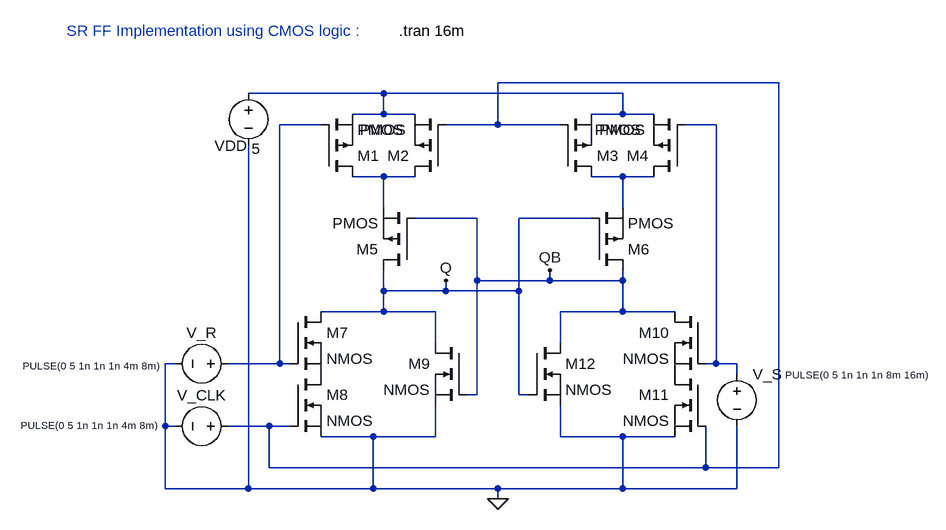
[diagram p0: schematic SR_FF_CMOS.asc]
SR_FF_CMOS.asc, the LTspice schematic file:
Version 4
SHEET 1 1336 680
WIRE 1024 -2000 592 -2000
WIRE 416 -1984 208 -1984
WIRE 784 -1984 416 -1984
WIRE 416 -1952 416 -1984
WIRE 416 -1952 368 -1952
WIRE 464 -1952 416 -1952
WIRE 784 -1952 784 -1984
WIRE 784 -1952 736 -1952
WIRE 832 -1952 784 -1952
WIRE 320 -1936 256 -1936
WIRE 592 -1936 592 -2000
WIRE 592 -1936 512 -1936
WIRE 688 -1936 592 -1936
WIRE 928 -1936 880 -1936
WIRE 416 -1856 368 -1856
WIRE 464 -1856 416 -1856
WIRE 784 -1856 736 -1856
WIRE 832 -1856 784 -1856
WIRE 416 -1808 416 -1856
WIRE 784 -1808 784 -1856
WIRE 560 -1792 464 -1792
WIRE 736 -1792 624 -1792
WIRE 560 -1696 560 -1792
WIRE 672 -1696 672 -1712
WIRE 672 -1696 560 -1696
WIRE 784 -1696 784 -1712
WIRE 784 -1696 672 -1696
WIRE 416 -1680 416 -1712
WIRE 512 -1680 512 -1696
WIRE 512 -1680 416 -1680
WIRE 624 -1680 624 -1792
WIRE 624 -1680 512 -1680
WIRE 416 -1648 416 -1680
WIRE 416 -1648 320 -1648
WIRE 496 -1648 416 -1648
WIRE 784 -1648 784 -1696
WIRE 784 -1648 688 -1648
WIRE 864 -1648 784 -1648
WIRE 496 -1600 496 -1648
WIRE 688 -1600 688 -1648
WIRE 96 -1568 80 -1568
WIRE 256 -1568 256 -1936
WIRE 256 -1568 176 -1568
WIRE 272 -1568 256 -1568
WIRE 928 -1568 928 -1936
WIRE 928 -1568 912 -1568
WIRE 960 -1568 928 -1568
WIRE 960 -1552 960 -1568
WIRE 560 -1520 560 -1696
WIRE 560 -1520 544 -1520
WIRE 624 -1520 624 -1680
WIRE 640 -1520 624 -1520
WIRE 80 -1472 80 -1568
WIRE 96 -1472 80 -1472
WIRE 240 -1472 176 -1472
WIRE 272 -1472 240 -1472
WIRE 400 -1456 320 -1456
WIRE 496 -1456 496 -1504
WIRE 496 -1456 400 -1456
WIRE 688 -1456 688 -1504
WIRE 784 -1456 688 -1456
WIRE 864 -1456 784 -1456
WIRE 240 -1408 240 -1472
WIRE 912 -1408 912 -1472
WIRE 912 -1408 240 -1408
WIRE 1024 -1408 1024 -2000
WIRE 1024 -1408 912 -1408
WIRE 80 -1376 80 -1472
WIRE 208 -1376 208 -1904
WIRE 208 -1376 80 -1376
WIRE 400 -1376 400 -1456
WIRE 400 -1376 208 -1376
WIRE 592 -1376 400 -1376
WIRE 784 -1376 784 -1456
WIRE 784 -1376 592 -1376
WIRE 960 -1376 960 -1472
WIRE 960 -1376 784 -1376
WIRE 592 -1360 592 -1376
FLAG 592 -1360 0
FLAG 672 -1712 QB
FLAG 512 -1696 Q
SYMBOL pmos 512 -1856 R180
WINDOW 3 66 72 Left 2
SYMATTR InstName M2
SYMBOL pmos 880 -1856 R180
WINDOW 3 68 72 Left 2
SYMATTR InstName M4
SYMBOL pmos 464 -1712 R180
SYMATTR InstName M5
SYMBOL pmos 736 -1712 M180
SYMATTR InstName M6
SYMBOL nmos 272 -1648 R0
SYMATTR InstName M7
SYMBOL nmos 272 -1552 R0
SYMATTR InstName M8
SYMBOL nmos 544 -1600 M0
SYMATTR InstName M9
SYMBOL nmos 912 -1648 M0
SYMATTR InstName M10
SYMBOL nmos 912 -1552 M0
SYMATTR InstName M11
SYMBOL nmos 640 -1600 R0
SYMATTR InstName M12
SYMBOL voltage 208 -2000 R0
WINDOW 0 -52 97 Left 2
WINDOW 3 5 101 Left 2
WINDOW 123 0 0 Left 0
WINDOW 39 0 0 Left 0
SYMATTR InstName VDD
SYMATTR Value 5
SYMBOL voltage 192 -1568 R90
WINDOW 0 -32 56 VBottom 2
WINDOW 3 -7 228 VTop 1
WINDOW 123 0 0 Left 0
WINDOW 39 0 0 Left 0
SYMATTR InstName V_R
SYMATTR Value PULSE(0 5 1n 1n 1n 4m 8m)
SYMBOL voltage 192 -1472 R90
WINDOW 0 -32 56 VBottom 2
WINDOW 3 -12 231 VTop 1
WINDOW 123 0 0 Left 0
WINDOW 39 0 0 Left 0
SYMATTR InstName V_CLK
SYMATTR Value PULSE(0 5 1n 1n 1n 4m 8m)
SYMBOL voltage 960 -1568 R0
WINDOW 3 74 17 Left 1
WINDOW 123 0 0 Left 0
WINDOW 39 0 0 Left 0
SYMATTR Value PULSE(0 5 1n 1n 1n 8m 16m)
SYMATTR InstName V_S
SYMBOL pmos 320 -1856 M180
WINDOW 3 60 72 Left 2
SYMATTR InstName M1
SYMBOL pmos 688 -1856 M180
WINDOW 3 60 72 Left 2
SYMATTR InstName M3
TEXT -72 -2080 Left 2 ;SR FF Implementation using CMOS logic :
TEXT 440 -2080 Left 2 !.tran 16m

The netlist it stands for:
* SR_FF_CMOS.asc
M2 N005 N001 N002 N002 PMOS
M4 N006 N004 N002 N002 PMOS
M5 Q QB N005 N005 PMOS
M6 QB Q N006 N006 PMOS
M7 Q N003 P001 P001 NMOS
M8 P001 N001 0 0 NMOS
M9 Q QB 0 0 NMOS
M10 QB N004 P002 P002 NMOS
M11 P002 N001 0 0 NMOS
M12 QB Q 0 0 NMOS
VDD N002 0 5
V_R N003 0 PULSE(0 5 1n 1n 1n 4m 8m)
V_CLK N001 0 PULSE(0 5 1n 1n 1n 4m 8m)
V_S N004 0 PULSE(0 5 1n 1n 1n 8m 16m)
M1 N005 N003 N002 N002 PMOS
M3 N006 N001 N002 N002 PMOS
.model NMOS NMOS
.model PMOS PMOS
.lib standard.mos
* SR FF Implementation using CMOS logic :
.tran 16m
.backanno
.end